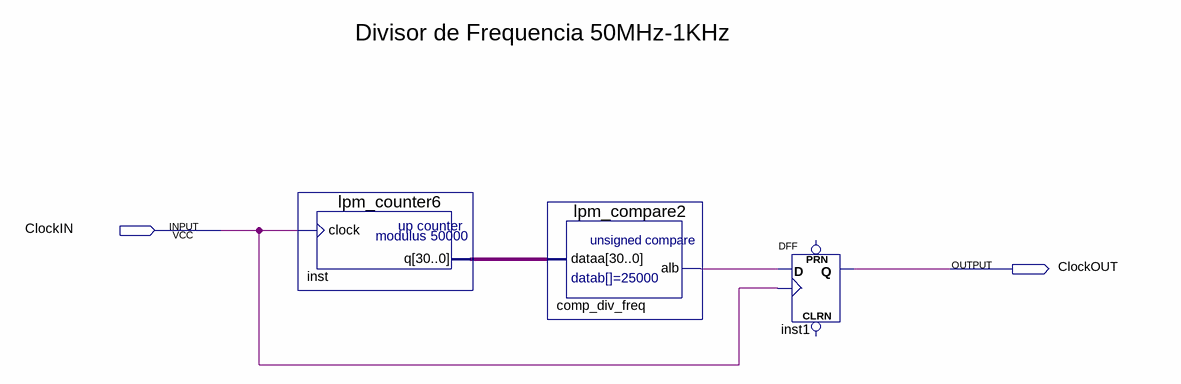
[diagram p0: schematic sheet]
// Quartus schematic FrequencyDivider.bdf as structural Verilog: 3 symbols, 2 pins
module FrequencyDivider (
  input  ClockIN,
  output ClockOUT
);

  wire comp_div_freq_alb;
  wire [30:0] inst_q;

  lpm_counter6 inst (.clock(ClockIN), .q(inst_q));
  lpm_compare2 comp_div_freq (.dataa(inst_q), .alb(comp_div_freq_alb));
  DFF inst1 (.CLK(ClockIN), .D(comp_div_freq_alb), .Q(ClockOUT));  // open: CLRN, PRN

  // Notes on the sheet:
  //   Divisor de Frequencia 50MHz-1KHz
endmodule
